# Altium schematic sheet FPGA.SchDoc
size A3; SheetNumber: 1; SheetTotal: 2
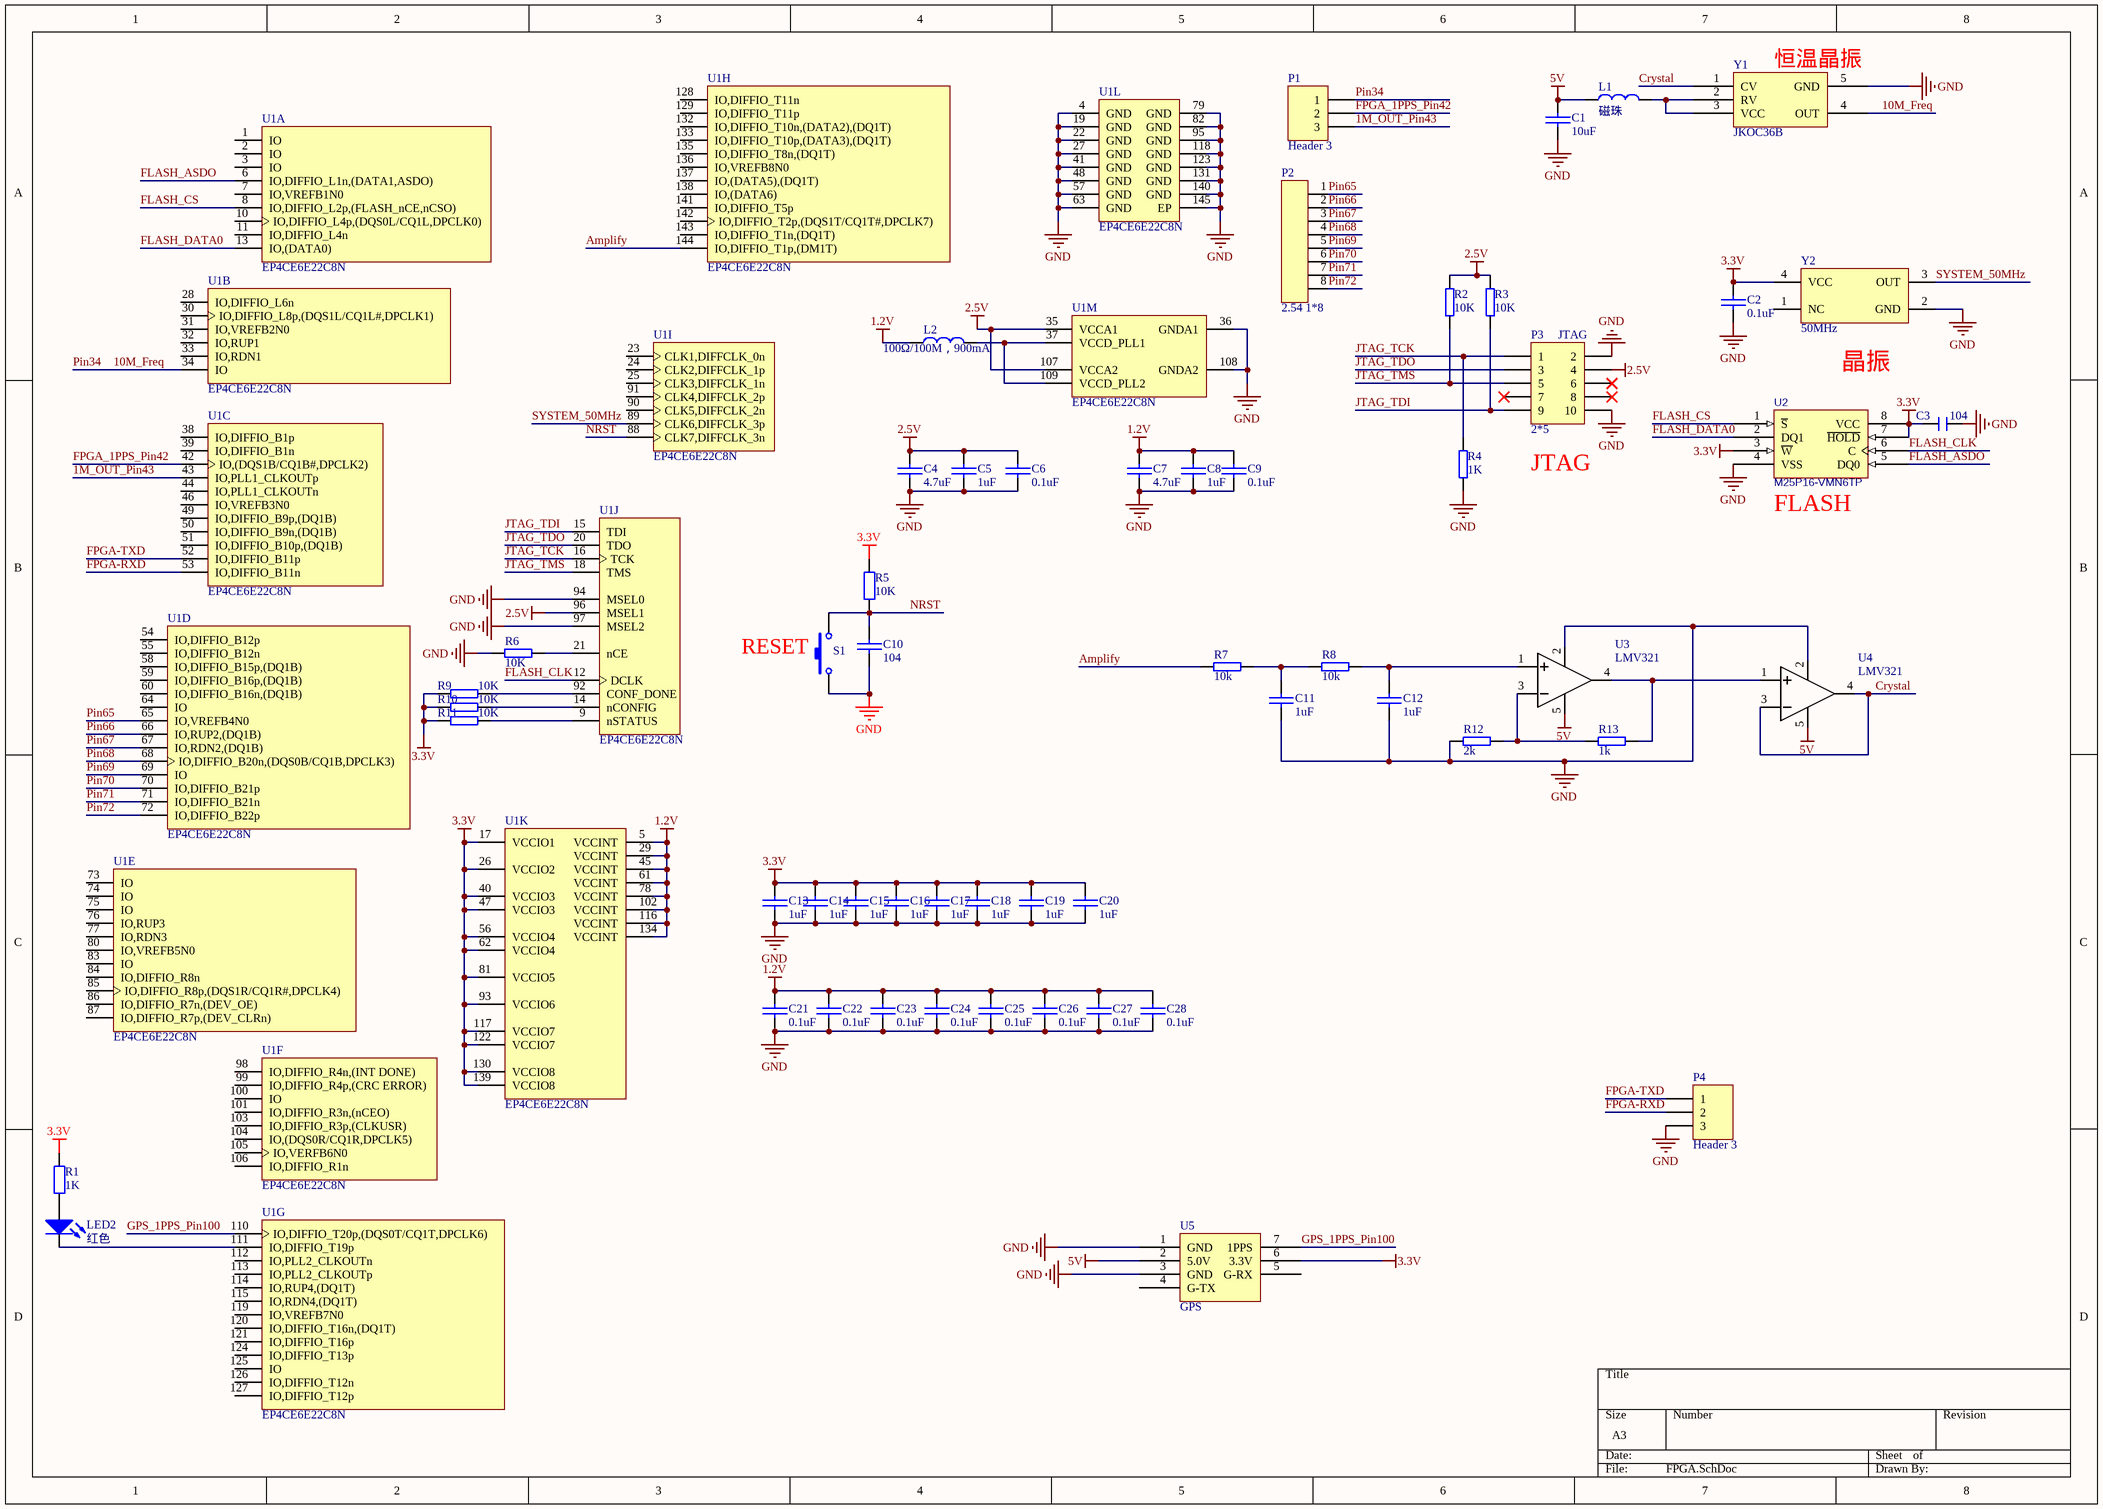
[diagram p0: FPGA.SchDoc]

## Parts
C1  10uF  [0805]
C2  0.1uF  [0805]
C3  104  [0805]
C4  4.7uF  [0805]
C5  1uF  [0805]
C6  0.1uF  [0805]
C7  4.7uF  [0805]
C8  1uF  [0805]
C9  0.1uF  [0805]
C10  104  [0805]
C11  1uF  [0805]
C12  1uF  [0805]
C13  1uF  [0805]
C14  1uF  [0805]
C15  1uF  [0805]
C16  1uF  [0805]
C17  1uF  [0805]
C18  1uF  [0805]
C19  1uF  [0805]
C20  1uF  [0805]
C21  0.1uF  [0805]
C22  0.1uF  [0805]
C23  0.1uF  [0805]
C24  0.1uF  [0805]
C25  0.1uF  [0805]
C26  0.1uF  [0805]
C27  0.1uF  [0805]
C28  0.1uF  [0805]
L1  磁珠  [0805]
L2  100Ω/100M，900mA  [0805]
LED2  红色  [LED0805]
P1  Header 3  [HDR1X3]
P2  2.54 1*8  [单排插针 2.54 1*8]
P3  JTAG  封装: 2*5  [DC3压线座 2.54 2*5]
P4  Header 3  [HDR1X3]
R1  1K  [0805]
R2  10K  [0805]
R3  10K  [0805]
R4  1K  [0805]
R5  10K  [0805]
R6  10K  [0805]
R7  10k  [0805]
R8  10k  [0805]
R9  10K  [0805]
R10  10K  [0805]
R11  10K  [0805]
R12  2k  [0805]
R13  1k  [0805]
S1  key  [按键 轻触  6*3]  (value not drawn)
U1  EP4CE6E22C8N  [EP4CE6E22C8N]  (parts A,B,C,D,E,F,G,H,I,J,K,L,M of 13)
U2  M25P16-VMN6TP  [SOIC-8]
U3  LMV321  [SOT23-5]
U4  LMV321  [SOT23-5]
U5  GPS  [GPS]
Y1  JKOC36B  [恒温晶振 10M]
Y2  50MHz  [晶振 有源 5*7]

## Nets
1.2V: C7.2 C8.2 C9.2 C21.2 C22.2 C23.2 C24.2 C25.2 C26.2 C27.2 C28.2 L2.1 U1.5(VCCINT) U1.29(VCCINT) U1.45(VCCINT) U1.61(VCCINT) U1.78(VCCINT) U1.102(VCCINT) U1.116(VCCINT) U1.134(VCCINT)
2.5V: C4.2 C5.2 C6.2 P3.4 R2.1 R3.1 U1.35(VCCA1) U1.96(MSEL1) U1.107(VCCA2)
3.3V: C2.2 C3.2 C13.2 C14.2 C15.2 C16.2 C17.2 C18.2 C19.2 C20.2 R1.1 R5.1 R9.2 R10.2 R11.2 U1.17(VCCIO1) U1.26(VCCIO2) U1.40(VCCIO3) U1.47(VCCIO3) U1.56(VCCIO4) U1.62(VCCIO4) U1.81(VCCIO5) U1.93(VCCIO6) U1.117(VCCIO7) U1.122(VCCIO7) U1.130(VCCIO8) U1.139(VCCIO8) U2.3(~{W}) U2.7(~{HOLD}) U2.8(VCC) U5.6(3.3V) Y2.4(VCC)
5V: C1.1 L1.1 U3.5(VCC) U4.5(VCC) U5.2(5.0V)
GND: C1.2 C2.1 C3.1 C4.1 C5.1 C6.1 C7.1 C8.1 C9.1 C10.1 C11.1 C12.1 C13.1 C14.1 C15.1 C16.1 C17.1 C18.1 C19.1 C20.1 C21.1 C22.1 C23.1 C24.1 C25.1 C26.1 C27.1 C28.1 P3.2 P3.10 P4.3 R4.2 R6.2 R12.2 S1.1 U1.4(GND) U1.19(GND) U1.22(GND) U1.27(GND) U1.36(GNDA1) U1.41(GND) U1.48(GND) U1.57(GND) U1.63(GND) U1.79(GND) U1.82(GND) U1.94(MSEL0) U1.95(GND) U1.97(MSEL2) U1.108(GNDA2) U1.118(GND) U1.123(GND) U1.131(GND) U1.140(GND) U1.145(EP) U2.4(VSS) U3.2(GND) U4.2(GND) U5.1(GND) U5.3(GND) Y1.5(GND) Y2.2(GND)
1M_OUT_Pin43: P1.3 U1.43(IO,PLL1_CLKOUTp)
10M_Freq: P1.1 U1.34(IO) Y1.4(OUT)  [also labelled Pin34]
Amplify: R7.2 U1.144(IO,DIFFIO_T1p,(DM1T))
Crystal: U4.3(IN-) U4.4(OUT) Y1.1(CV)
FLASH_ASDO: U1.6(IO,DIFFIO_L1n,(DATA1,ASDO)) U2.5(DQ0)
FLASH_CLK: U1.12(DCLK) U2.6(C)
FLASH_CS: U1.8(IO,DIFFIO_L2p,(FLASH_nCE,nCSO)) U2.1(~{S})
FLASH_DATA0: U1.13(IO,(DATA0)) U2.2(DQ1)
FPGA-RXD: P4.2 U1.53(IO,DIFFIO_B11n)
FPGA-TXD: P4.1 U1.52(IO,DIFFIO_B11p)
FPGA_1PPS_Pin42: P1.2 U1.42(IO,(DQS1B/CQ1B#,DPCLK2))
GPS_1PPS_Pin100: U1.110(IO,DIFFIO_T20p,(DQS0T/CQ1T,DPCLK6)) U5.7(1PPS)
JTAG_TCK: P3.1 R4.1 U1.16(TCK)
JTAG_TDI: P3.9 R3.2 U1.15(TDI)
JTAG_TDO: P3.3 U1.20(TDO)
JTAG_TMS: P3.5 R2.2 U1.18(TMS)
NRST: C10.2 R5.2 S1.2 U1.88(CLK7,DIFFCLK_3n)
Pin65: P2.1 U1.65(IO,VREFB4N0)
Pin66: P2.2 U1.66(IO,RUP2,(DQ1B))
Pin67: P2.3 U1.67(IO,RDN2,(DQ1B))
Pin68: P2.4 U1.68(IO,DIFFIO_B20n,(DQS0B/CQ1B,DPCLK3))
Pin69: P2.5 U1.69(IO)
Pin70: P2.6 U1.70(IO,DIFFIO_B21p)
Pin71: P2.7 U1.71(IO,DIFFIO_B21n)
Pin72: P2.8 U1.72(IO,DIFFIO_B22p)
SYSTEM_50MHz: U1.89(CLK6,DIFFCLK_3p) Y2.3(OUT)
NetC11_2: C11.2 R7.1 R8.2
NetC12_2: C12.2 R8.1 U3.1(IN+)
NetL1_2: L1.2 Y1.2(RV) Y1.3(VCC)
NetL2_2: L2.2 U1.37(VCCD_PLL1) U1.109(VCCD_PLL2)
NetLED2_1: LED2.1(A) R1.2
NetLED2_2: LED2.2(K) U1.111(IO,DIFFIO_T19p)
NetR6_1: R6.1 U1.21(nCE)
NetR9_1: R9.1 U1.92(CONF_DONE)
NetR10_1: R10.1 U1.14(nCONFIG)
NetR11_1: R11.1 U1.9(nSTATUS)
NetR12_1: R12.1 R13.2 U3.3(IN-)
NetR13_1: R13.1 U3.4(OUT) U4.1(IN+)

Not connected (* = marked no-connect by the designer): P3 6* 7* 8*; U1 1(IO) 2(IO) 3(IO) 7(IO,VREFB1N0) 10(IO,DIFFIO_L4p,(DQS0L/CQ1L,DPCLK0)) 11(IO,DIFFIO_L4n) 23(CLK1,DIFFCLK_0n) 24(CLK2,DIFFCLK_1p) 25(CLK3,DIFFCLK_1n) 28(IO,DIFFIO_L6n) 30(IO,DIFFIO_L8p,(DQS1L/CQ1L#,DPCLK1)) 31(IO,VREFB2N0) 32(IO,RUP1) 33(IO,RDN1) 38(IO,DIFFIO_B1p) 39(IO,DIFFIO_B1n) 44(IO,PLL1_CLKOUTn) 46(IO,VREFB3N0) 49(IO,DIFFIO_B9p,(DQ1B)) 50(IO,DIFFIO_B9n,(DQ1B)) 51(IO,DIFFIO_B10p,(DQ1B)) 54(IO,DIFFIO_B12p) 55(IO,DIFFIO_B12n) 58(IO,DIFFIO_B15p,(DQ1B)) 59(IO,DIFFIO_B16p,(DQ1B)) 60(IO,DIFFIO_B16n,(DQ1B)) 64(IO) 73(IO) 74(IO) 75(IO) 76(IO,RUP3) 77(IO,RDN3) 80(IO,VREFB5N0) 83(IO) 84(IO,DIFFIO_R8n) 85(IO,DIFFIO_R8p,(DQS1R/CQ1R#,DPCLK4)) 86(IO,DIFFIO_R7n,(DEV_OE)) 87(IO,DIFFIO_R7p,(DEV_CLRn)) 90(CLK5,DIFFCLK_2n) 91(CLK4,DIFFCLK_2p) 98(IO,DIFFIO_R4n,(INT_DONE)) 99(IO,DIFFIO_R4p,(CRC_ERROR)) 100(IO) 101(IO,DIFFIO_R3n,(nCEO)) 103(IO,DIFFIO_R3p,(CLKUSR)) 104(IO,(DQS0R/CQ1R,DPCLK5)) 105(IO,VERFB6N0) 106(IO,DIFFIO_R1n) 112(IO,PLL2_CLKOUTn) 113(IO,PLL2_CLKOUTp) 114(IO,RUP4,(DQ1T)) 115(IO,RDN4,(DQ1T)) 119(IO,VREFB7N0) 120(IO,DIFFIO_T16n,(DQ1T)) 121(IO,DIFFIO_T16p) 124(IO,DIFFIO_T13p) 125(IO) 126(IO,DIFFIO_T12n) 127(IO,DIFFIO_T12p) 128(IO,DIFFIO_T11n) 129(IO,DIFFIO_T11p) 132(IO,DIFFIO_T10n,(DATA2),(DQ1T)) 133(IO,DIFFIO_T10p,(DATA3),(DQ1T)) 135(IO,DIFFIO_T8n,(DQ1T)) 136(IO,VREFB8N0) 137(IO,(DATA5),(DQ1T)) 138(IO,(DATA6)) 141(IO,DIFFIO_T5p) 142(IO,DIFFIO_T2p,(DQS1T/CQ1T#,DPCLK7)) 143(IO,DIFFIO_T1n,(DQ1T)); U5 4(G-TX) 5(G-RX); Y2 1(NC)

## Notes on the sheet
- (near Y1) 恒温晶振
- 晶振
- (near P3) JTAG
- (near U2) FLASH
- (near S1) RESET

## Library data of the parts
C1 C2 C4-C9 C11-C28 = 电容 贴片 0805: 名称: 贴片电容; 单位: 个; 封装: 0805
C3 = C: 无极性贴片电容; 版权归属: 源创客; 材质: X7R; BOM名称: 无极性贴片电容; 学习资源: www.ooocke.com
C10 = 贴片电容 0805: 名称: 贴片电容; 封装: 0603; 单位: 个
L1 L2 = 磁珠: 单位: 个; 名称: 磁珠; 封装: 0805
LED2 = 二极管 贴片发光 0805: 名称: 贴片发光二极管; 封装: 0805; 单位: 个
P1 P4 = Header 3: Header, 3-Pin; LatestRevisionDate: 17-Jul-2002; LatestRevisionNote: Re-released for DXP Platform.; Publisher: Altium Limited
P2 = 联结件 单排插针 2.54 1*8: 单位: 片; 封装: DIP; 名称: 单排插针
P3 = 联结件 DC3 2*5: 名称: 联结件; 单位: 个
R1 = 贴片电阻 0805: 名称: 贴片电阻; 单位: 个; 封装: 0805
R2-R4 R6-R13 = 电阻 贴片 0805: 名称: 贴片电阻; 单位: 个; 封装: 0805
R5 = 贴片电阻 0603: 名称: 贴片电阻; 封装: 0603; 单位: 个
S1 = 按键 轻触 3*6: 单位: 个; 名称: 开关; 封装: 直插 12*12*12
U1 = 贴片芯片 EP4CE6E22C8N
U2 = M25P16-VMN6TP: BOM_Manufacturer: micron(镁光); Contributor: LCSC; BOM_Supplier: LCSC; BOM_Manufacturer Part: M25P16-VMN6TP; BOM_Supplier Part: C151067; BOM_JLCPCB Part Class: Extended Part; spicePre: U; spiceSymbolName: M25P16-VMN6TP
U3 U4 = 贴片芯片 LMV321: 单位: 个; 名称: 芯片; 封装: SOT23-5
Y1 = 恒温晶振 10M
Y2 = 晶振 有源: 名称: 晶振; 封装: 贴片; 单位: 个